# EAGLE schematic Motor_Cape (EAGLE 7.7.0)
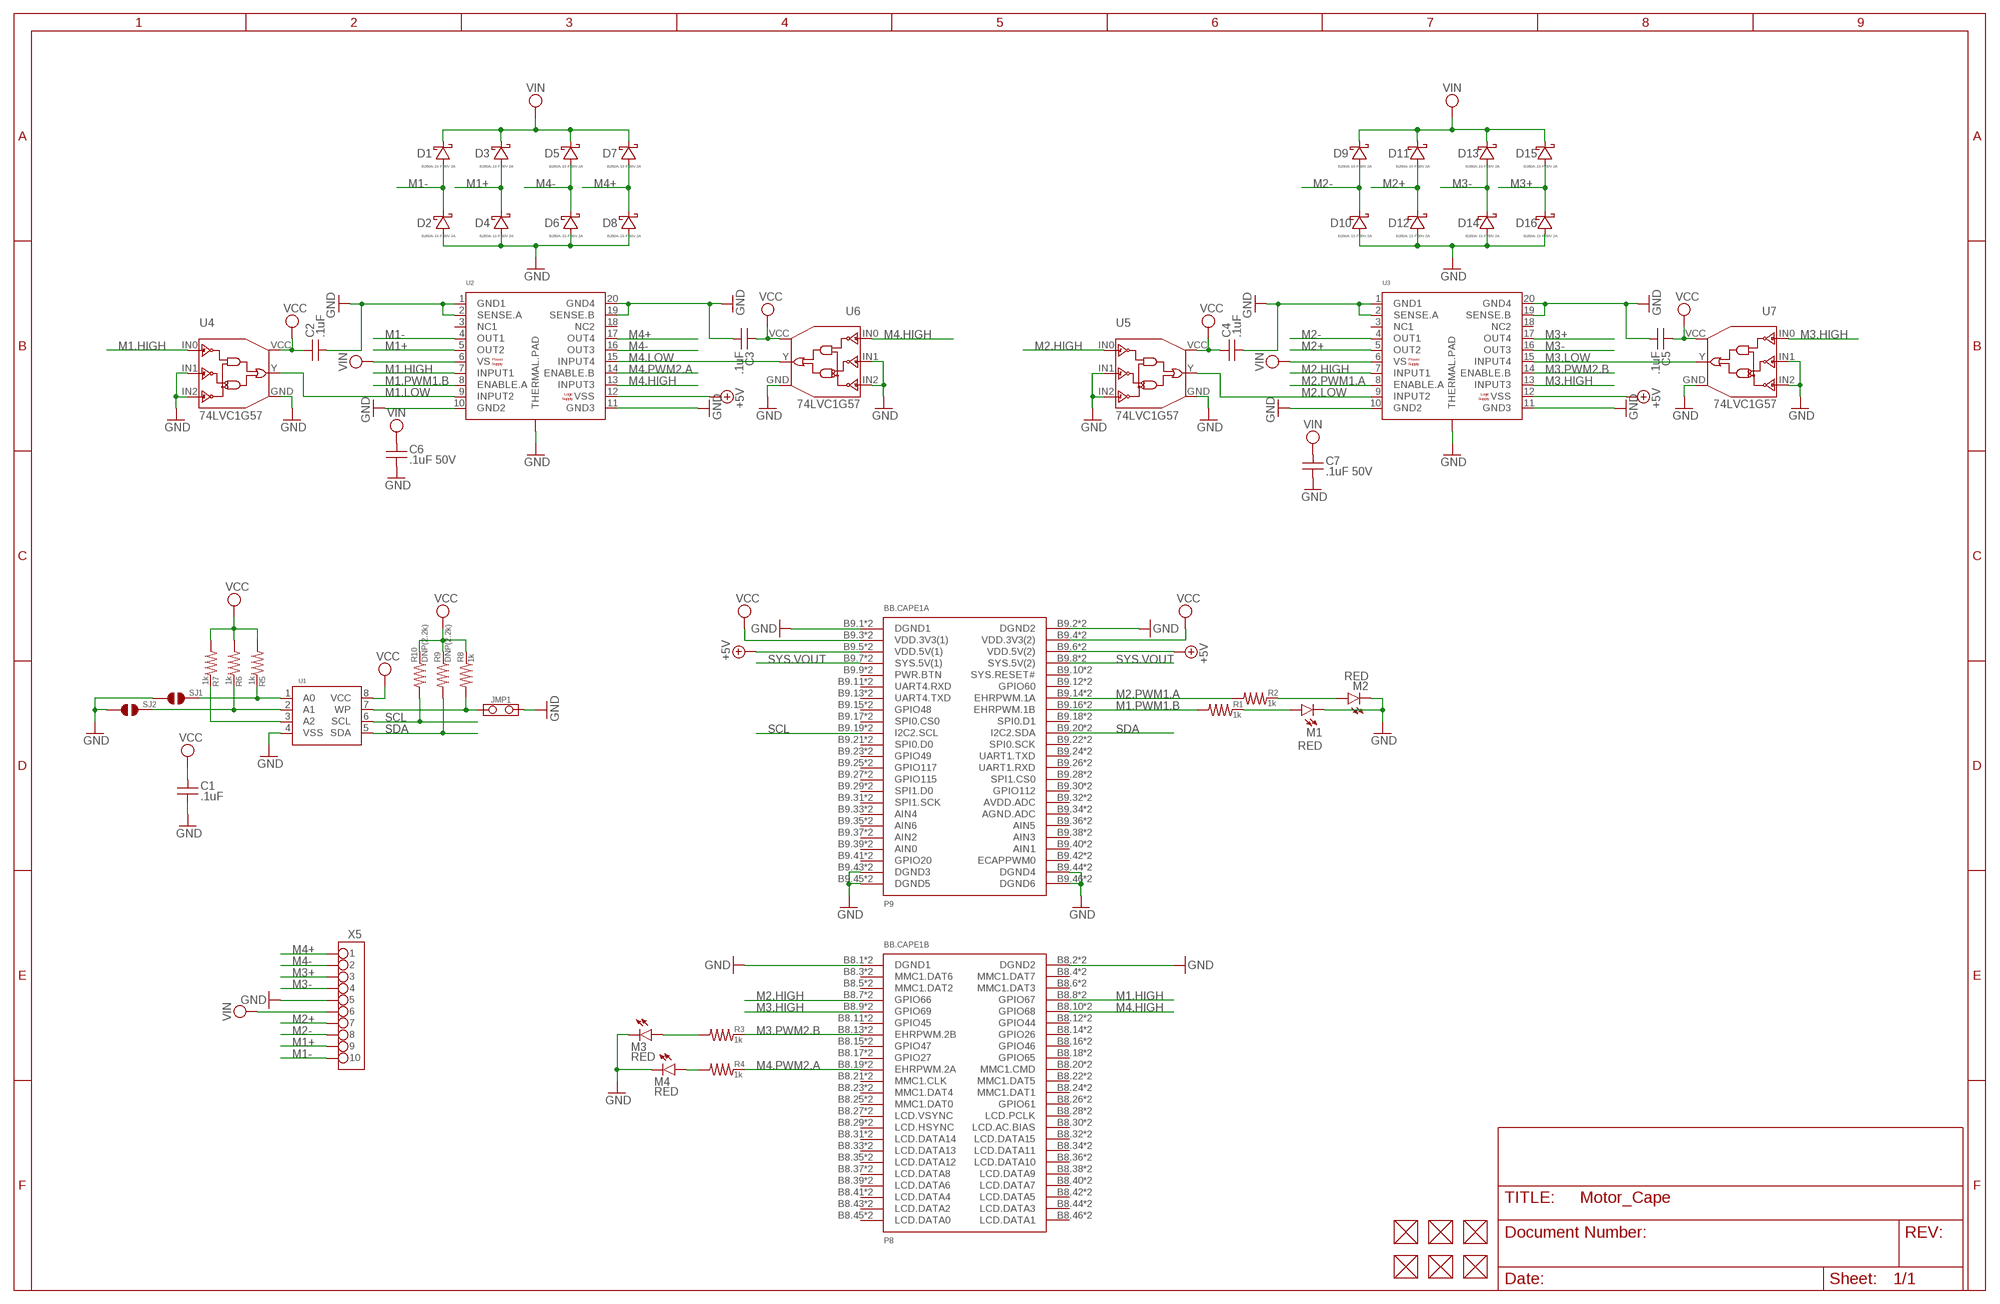
[diagram p0: schematic, sheet 1]

## Parts
BB.CAPE1  BEAGLEBONE.CAPE.TOP/BOTTOM-PADS  [BEAGLEBONE.CAPE.TOP/BOTTOM-PADS]
C1  .1uF  CAPACITOR-(INCH)-0402  [0402]
C2  .1uF  CAPACITOR-(INCH)-0402  [0402]
C3  .1uF  CAPACITOR-(INCH)-0402  [0402]
C4  .1uF  CAPACITOR-(INCH)-0402  [0402]
C5  .1uF  CAPACITOR-(INCH)-0402  [0402]
C6  .1uF 50V  CAPACITOR-(INCH)-0603  [0603]
C7  .1uF 50V  CAPACITOR-(INCH)-0603  [0603]
D1  B260A-13-F 60V 2A  DIODE-SCHOTTKY-(DIODES)-SMA  [SMA(DIODES)]
D2  B260A-13-F 60V 2A  DIODE-SCHOTTKY-(DIODES)-SMA  [SMA(DIODES)]
D3  B260A-13-F 60V 2A  DIODE-SCHOTTKY-(DIODES)-SMA  [SMA(DIODES)]
D4  B260A-13-F 60V 2A  DIODE-SCHOTTKY-(DIODES)-SMA  [SMA(DIODES)]
D5  B260A-13-F 60V 2A  DIODE-SCHOTTKY-(DIODES)-SMA  [SMA(DIODES)]
D6  B260A-13-F 60V 2A  DIODE-SCHOTTKY-(DIODES)-SMA  [SMA(DIODES)]
D7  B260A-13-F 60V 2A  DIODE-SCHOTTKY-(DIODES)-SMA  [SMA(DIODES)]
D8  B260A-13-F 60V 2A  DIODE-SCHOTTKY-(DIODES)-SMA  [SMA(DIODES)]
D9  B260A-13-F 60V 2A  DIODE-SCHOTTKY-(DIODES)-SMA  [SMA(DIODES)]
D10  B260A-13-F 60V 2A  DIODE-SCHOTTKY-(DIODES)-SMA  [SMA(DIODES)]
D11  B260A-13-F 60V 2A  DIODE-SCHOTTKY-(DIODES)-SMA  [SMA(DIODES)]
D12  B260A-13-F 60V 2A  DIODE-SCHOTTKY-(DIODES)-SMA  [SMA(DIODES)]
D13  B260A-13-F 60V 2A  DIODE-SCHOTTKY-(DIODES)-SMA  [SMA(DIODES)]
D14  B260A-13-F 60V 2A  DIODE-SCHOTTKY-(DIODES)-SMA  [SMA(DIODES)]
D15  B260A-13-F 60V 2A  DIODE-SCHOTTKY-(DIODES)-SMA  [SMA(DIODES)]
D16  B260A-13-F 60V 2A  DIODE-SCHOTTKY-(DIODES)-SMA  [SMA(DIODES)]
FUD1  FIDUCIAL  [FIDUCIAL_40MIL]
FUD2  FIDUCIAL  [FIDUCIAL_40MIL]
FUD3  FIDUCIAL  [FIDUCIAL_40MIL]
FUD4  FIDUCIAL  [FIDUCIAL_40MIL]
FUD5  FIDUCIAL  [FIDUCIAL_40MIL]
FUD6  FIDUCIAL  [FIDUCIAL_40MIL]
JMP1  JUMPER-(X2)  [JUMPER-(X2)]
M1  RED  LED-(INCH)-0805  [0805-LED]
M2  RED  LED-(INCH)-0805  [0805-LED]
M3  RED  LED-(INCH)-0805  [0805-LED]
M4  RED  LED-(INCH)-0805  [0805-LED]
R1  1k  RESISTOR-(INCH)-0402  [0402]
R2  1k  RESISTOR-(INCH)-0402  [0402]
R3  1k  RESISTOR-(INCH)-0402  [0402]
R4  1k  RESISTOR-(INCH)-0402  [0402]
R5  1k  RESISTOR-(INCH)-0402  [0402]
R6  1k  RESISTOR-(INCH)-0402  [0402]
R7  1k  RESISTOR-(INCH)-0402  [0402]
R8  1k  RESISTOR-(INCH)-0402  [0402]
R9  DNP(2.2k)  RESISTOR-(INCH)-0402  [0402]
R10  DNP(2.2k)  RESISTOR-(INCH)-0402  [0402]
SJ1  SOLDER.JOINT-(INCH)-0402  [SOLDER.JOINT(0402)]
SJ2  SOLDER.JOINT-(INCH)-0402  [SOLDER.JOINT(0402)]
U1  CAT24C32  [UDFN8,2X3(ON-SEMI)]
U2  ST-L298-TP(VERSION.A)-W/TV  [POWER.SO-20(ST)-A.W/TV]
U3  ST-L298-TP(VERSION.A)-W/TV  [POWER.SO-20(ST)-A.W/TV]
U4  74LVC1G57  [SOT-23-6]
U5  74LVC1G57  [SOT-23-6]
U6  74LVC1G57  [SOT-23-6]
U7  74LVC1G57  [SOT-23-6]
X5  TB-10TERM-150MIL.PITCH  [TERMINAL.BLOCK-10TERM-150MIL.PITCH]

## Nets
+5V [power]: BB.CAPE1.B9.5(A:VDD.5V(1)) BB.CAPE1.B9.6(A:VDD.5V(2)) BB.CAPE1.T9.5(A:VDD.5V(1)) BB.CAPE1.T9.6(A:VDD.5V(2)) U2.12(VSS) U3.12(VSS)
A0: R5.2 SJ1.2 U1.1(A0)
A1: R6.2 SJ2.2 U1.2(A1)
A2: R7.2 U1.3(A2)
GND: BB.CAPE1.B8.1(B:DGND1) BB.CAPE1.B8.2(B:DGND2) BB.CAPE1.B9.1(A:DGND1) BB.CAPE1.B9.2(A:DGND2) BB.CAPE1.B9.43(A:DGND3) BB.CAPE1.B9.44(A:DGND4) BB.CAPE1.B9.45(A:DGND5) BB.CAPE1.B9.46(A:DGND6) BB.CAPE1.T8.1(B:DGND1) BB.CAPE1.T8.2(B:DGND2) BB.CAPE1.T9.1(A:DGND1) BB.CAPE1.T9.2(A:DGND2) BB.CAPE1.T9.43(A:DGND3) BB.CAPE1.T9.44(A:DGND4) BB.CAPE1.T9.45(A:DGND5) BB.CAPE1.T9.46(A:DGND6) C1.2 C2.2 C3.2 C4.2 C5.2 C6.2 C7.2 D2.A(ANODE) D4.A(ANODE) D6.A(ANODE) D8.A(ANODE) D10.A(ANODE) D12.A(ANODE) D14.A(ANODE) D16.A(ANODE) JMP1.2 M1.K M2.K M3.K M4.K SJ1.1 SJ2.1 U1.4(VSS) U2.1(GND1) U2.2(SENSE.A) U2.10(GND2) U2.11(GND3) U2.19(SENSE.B) U2.20(GND4) U2.THERMAL.PAD U2.TV1(THERMAL.PAD) U2.TV2(THERMAL.PAD) U2.TV3(THERMAL.PAD) U2.TV4(THERMAL.PAD) U2.TV5(THERMAL.PAD) U2.TV6(THERMAL.PAD) U2.TV7(THERMAL.PAD) U2.TV8(THERMAL.PAD) U2.TV9(THERMAL.PAD) U2.TV10(THERMAL.PAD) U2.TV11(THERMAL.PAD) U2.TV12(THERMAL.PAD) U2.TV13(THERMAL.PAD) U2.TV14(THERMAL.PAD) U2.TV15(THERMAL.PAD) U2.TV16(THERMAL.PAD) U2.TV17(THERMAL.PAD) U2.TV18(THERMAL.PAD) U2.TV19(THERMAL.PAD) U2.TV20(THERMAL.PAD) U2.TV21(THERMAL.PAD) U3.1(GND1) U3.2(SENSE.A) U3.10(GND2) U3.11(GND3) U3.19(SENSE.B) U3.20(GND4) U3.THERMAL.PAD U3.TV1(THERMAL.PAD) U3.TV2(THERMAL.PAD) U3.TV3(THERMAL.PAD) U3.TV4(THERMAL.PAD) U3.TV5(THERMAL.PAD) U3.TV6(THERMAL.PAD) U3.TV7(THERMAL.PAD) U3.TV8(THERMAL.PAD) U3.TV9(THERMAL.PAD) U3.TV10(THERMAL.PAD) U3.TV11(THERMAL.PAD) U3.TV12(THERMAL.PAD) U3.TV13(THERMAL.PAD) U3.TV14(THERMAL.PAD) U3.TV15(THERMAL.PAD) U3.TV16(THERMAL.PAD) U3.TV17(THERMAL.PAD) U3.TV18(THERMAL.PAD) U3.TV19(THERMAL.PAD) U3.TV20(THERMAL.PAD) U3.TV21(THERMAL.PAD) U4.GND U4.IN1 U4.IN2 U5.GND U5.IN1 U5.IN2 U6.GND U6.IN1 U6.IN2 U7.GND U7.IN1 U7.IN2 X5.5
M1+: D3.A(ANODE) D4.K(CATHODE) U2.5(OUT2) X5.9
M1-: D1.A(ANODE) D2.K(CATHODE) U2.4(OUT1) X5.10
M1.HIGH: BB.CAPE1.B8.8(B:GPIO67) BB.CAPE1.T8.8(B:GPIO67) U2.7(INPUT1) U4.IN0
M1.LOW: U2.9(INPUT2) U4.Y
M1.PWM1.B: BB.CAPE1.B9.16(A:EHRPWM.1B) BB.CAPE1.T9.16(A:EHRPWM.1B) R1.1 U2.8(ENABLE.A)
M2+: D11.A(ANODE) D12.K(CATHODE) U3.5(OUT2) X5.7
M2-: D9.A(ANODE) D10.K(CATHODE) U3.4(OUT1) X5.8
M2.HIGH: BB.CAPE1.B8.7(B:GPIO66) BB.CAPE1.T8.7(B:GPIO66) U3.7(INPUT1) U5.IN0
M2.LOW: U3.9(INPUT2) U5.Y
M2.PWM1.A: BB.CAPE1.B9.14(A:EHRPWM.1A) BB.CAPE1.T9.14(A:EHRPWM.1A) R2.1 U3.8(ENABLE.A)
M3+: D15.A(ANODE) D16.K(CATHODE) U3.17(OUT4) X5.3
M3-: D13.A(ANODE) D14.K(CATHODE) U3.16(OUT3) X5.4
M3.HIGH: BB.CAPE1.B8.9(B:GPIO69) BB.CAPE1.T8.9(B:GPIO69) U3.13(INPUT3) U7.IN0
M3.LOW: U3.15(INPUT4) U7.Y
M3.PWM2.B: BB.CAPE1.B8.13(B:EHRPWM.2B) BB.CAPE1.T8.13(B:EHRPWM.2B) R3.2 U3.14(ENABLE.B)
M4+: D7.A(ANODE) D8.K(CATHODE) U2.17(OUT4) X5.1
M4-: D5.A(ANODE) D6.K(CATHODE) U2.16(OUT3) X5.2
M4.HIGH: BB.CAPE1.B8.10(B:GPIO68) BB.CAPE1.T8.10(B:GPIO68) U2.13(INPUT3) U6.IN0
M4.LOW: U2.15(INPUT4) U6.Y
M4.PWM2.A: BB.CAPE1.B8.19(B:EHRPWM.2A) BB.CAPE1.T8.19(B:EHRPWM.2A) R4.2 U2.14(ENABLE.B)
N$3: M1.A R1.2
N$4: M2.A R2.2
N$5: M3.A R3.1
N$6: M4.A R4.1
SCL: BB.CAPE1.B9.19(A:I2C2.SCL) BB.CAPE1.T9.19(A:I2C2.SCL) R10.1 U1.6(SCL)
SDA: BB.CAPE1.B9.20(A:I2C2.SDA) BB.CAPE1.T9.20(A:I2C2.SDA) R9.1 U1.5(SDA)
SYS.VOUT: BB.CAPE1.B9.7(A:SYS.5V(1)) BB.CAPE1.B9.8(A:SYS.5V(2)) BB.CAPE1.T9.7(A:SYS.5V(1)) BB.CAPE1.T9.8(A:SYS.5V(2))
VCC: BB.CAPE1.B9.3(A:VDD.3V3(1)) BB.CAPE1.B9.4(A:VDD.3V3(2)) BB.CAPE1.T9.3(A:VDD.3V3(1)) BB.CAPE1.T9.4(A:VDD.3V3(2)) C1.1 C2.1 C3.1 C4.1 C5.1 R5.1 R6.1 R7.1 R8.2 R9.2 R10.2 U1.8(VCC) U4.VCC U5.VCC U6.VCC U7.VCC
VIN: C6.1 C7.1 D1.K(CATHODE) D3.K(CATHODE) D5.K(CATHODE) D7.K(CATHODE) D9.K(CATHODE) D11.K(CATHODE) D13.K(CATHODE) D15.K(CATHODE) U2.6(VS) U3.6(VS) X5.6
WP: JMP1.1 R8.1 U1.7(WP)
Unconnected: BB.CAPE1.B8.3(B:MMC1.DAT6) BB.CAPE1.B8.4(B:MMC1.DAT7) BB.CAPE1.B8.5(B:MMC1.DAT2) BB.CAPE1.B8.6(B:MMC1.DAT3) BB.CAPE1.B8.11(B:GPIO45) BB.CAPE1.B8.12(B:GPIO44) BB.CAPE1.B8.14(B:GPIO26) BB.CAPE1.B8.15(B:GPIO47) BB.CAPE1.B8.16(B:GPIO46) BB.CAPE1.B8.17(B:GPIO27) BB.CAPE1.B8.18(B:GPIO65) BB.CAPE1.B8.20(B:MMC1.CMD) BB.CAPE1.B8.21(B:MMC1.CLK) BB.CAPE1.B8.22(B:MMC1.DAT5) BB.CAPE1.B8.23(B:MMC1.DAT4) BB.CAPE1.B8.24(B:MMC1.DAT1) BB.CAPE1.B8.25(B:MMC1.DAT0) BB.CAPE1.B8.26(B:GPIO61) BB.CAPE1.B8.27(B:LCD.VSYNC) BB.CAPE1.B8.28(B:LCD.PCLK) BB.CAPE1.B8.29(B:LCD.HSYNC) BB.CAPE1.B8.30(B:LCD.AC.BIAS) BB.CAPE1.B8.31(B:LCD.DATA14) BB.CAPE1.B8.32(B:LCD.DATA15) BB.CAPE1.B8.33(B:LCD.DATA13) BB.CAPE1.B8.34(B:LCD.DATA11) BB.CAPE1.B8.35(B:LCD.DATA12) BB.CAPE1.B8.36(B:LCD.DATA10) BB.CAPE1.B8.37(B:LCD.DATA8) BB.CAPE1.B8.38(B:LCD.DATA9) BB.CAPE1.B8.39(B:LCD.DATA6) BB.CAPE1.B8.40(B:LCD.DATA7) BB.CAPE1.B8.41(B:LCD.DATA4) BB.CAPE1.B8.42(B:LCD.DATA5) BB.CAPE1.B8.43(B:LCD.DATA2) BB.CAPE1.B8.44(B:LCD.DATA3) BB.CAPE1.B8.45(B:LCD.DATA0) BB.CAPE1.B8.46(B:LCD.DATA1) BB.CAPE1.B9.9(A:PWR.BTN) BB.CAPE1.B9.10(A:SYS.RESET#) BB.CAPE1.B9.11(A:UART4.RXD) BB.CAPE1.B9.12(A:GPIO60) BB.CAPE1.B9.13(A:UART4.TXD) BB.CAPE1.B9.15(A:GPIO48) BB.CAPE1.B9.17(A:SPI0.CS0) BB.CAPE1.B9.18(A:SPI0.D1) BB.CAPE1.B9.21(A:SPI0.D0) BB.CAPE1.B9.22(A:SPI0.SCK) BB.CAPE1.B9.23(A:GPIO49) BB.CAPE1.B9.24(A:UART1.TXD) BB.CAPE1.B9.25(A:GPIO117) BB.CAPE1.B9.26(A:UART1.RXD) BB.CAPE1.B9.27(A:GPIO115) BB.CAPE1.B9.28(A:SPI1.CS0) BB.CAPE1.B9.29(A:SPI1.D0) BB.CAPE1.B9.30(A:GPIO112) BB.CAPE1.B9.31(A:SPI1.SCK) BB.CAPE1.B9.32(A:AVDD.ADC) BB.CAPE1.B9.33(A:AIN4) BB.CAPE1.B9.34(A:AGND.ADC) BB.CAPE1.B9.35(A:AIN6) BB.CAPE1.B9.36(A:AIN5) BB.CAPE1.B9.37(A:AIN2) BB.CAPE1.B9.38(A:AIN3) BB.CAPE1.B9.39(A:AIN0) BB.CAPE1.B9.40(A:AIN1) BB.CAPE1.B9.41(A:GPIO20) BB.CAPE1.B9.42(A:ECAPPWM0) BB.CAPE1.T8.3(B:MMC1.DAT6) BB.CAPE1.T8.4(B:MMC1.DAT7) BB.CAPE1.T8.5(B:MMC1.DAT2) BB.CAPE1.T8.6(B:MMC1.DAT3) BB.CAPE1.T8.11(B:GPIO45) BB.CAPE1.T8.12(B:GPIO44) BB.CAPE1.T8.14(B:GPIO26) BB.CAPE1.T8.15(B:GPIO47) BB.CAPE1.T8.16(B:GPIO46) BB.CAPE1.T8.17(B:GPIO27) BB.CAPE1.T8.18(B:GPIO65) BB.CAPE1.T8.20(B:MMC1.CMD) BB.CAPE1.T8.21(B:MMC1.CLK) BB.CAPE1.T8.22(B:MMC1.DAT5) BB.CAPE1.T8.23(B:MMC1.DAT4) BB.CAPE1.T8.24(B:MMC1.DAT1) BB.CAPE1.T8.25(B:MMC1.DAT0) BB.CAPE1.T8.26(B:GPIO61) BB.CAPE1.T8.27(B:LCD.VSYNC) BB.CAPE1.T8.28(B:LCD.PCLK) BB.CAPE1.T8.29(B:LCD.HSYNC) BB.CAPE1.T8.30(B:LCD.AC.BIAS) BB.CAPE1.T8.31(B:LCD.DATA14) BB.CAPE1.T8.32(B:LCD.DATA15) BB.CAPE1.T8.33(B:LCD.DATA13) BB.CAPE1.T8.34(B:LCD.DATA11) BB.CAPE1.T8.35(B:LCD.DATA12) BB.CAPE1.T8.36(B:LCD.DATA10) BB.CAPE1.T8.37(B:LCD.DATA8) BB.CAPE1.T8.38(B:LCD.DATA9) BB.CAPE1.T8.39(B:LCD.DATA6) BB.CAPE1.T8.40(B:LCD.DATA7) BB.CAPE1.T8.41(B:LCD.DATA4) BB.CAPE1.T8.42(B:LCD.DATA5) BB.CAPE1.T8.43(B:LCD.DATA2) BB.CAPE1.T8.44(B:LCD.DATA3) BB.CAPE1.T8.45(B:LCD.DATA0) BB.CAPE1.T8.46(B:LCD.DATA1) BB.CAPE1.T9.9(A:PWR.BTN) BB.CAPE1.T9.10(A:SYS.RESET#) BB.CAPE1.T9.11(A:UART4.RXD) BB.CAPE1.T9.12(A:GPIO60) BB.CAPE1.T9.13(A:UART4.TXD) BB.CAPE1.T9.15(A:GPIO48) BB.CAPE1.T9.17(A:SPI0.CS0) BB.CAPE1.T9.18(A:SPI0.D1) BB.CAPE1.T9.21(A:SPI0.D0) BB.CAPE1.T9.22(A:SPI0.SCK) BB.CAPE1.T9.23(A:GPIO49) BB.CAPE1.T9.24(A:UART1.TXD) BB.CAPE1.T9.25(A:GPIO117) BB.CAPE1.T9.26(A:UART1.RXD) BB.CAPE1.T9.27(A:GPIO115) BB.CAPE1.T9.28(A:SPI1.CS0) BB.CAPE1.T9.29(A:SPI1.D0) BB.CAPE1.T9.30(A:GPIO112) BB.CAPE1.T9.31(A:SPI1.SCK) BB.CAPE1.T9.32(A:AVDD.ADC) BB.CAPE1.T9.33(A:AIN4) BB.CAPE1.T9.34(A:AGND.ADC) BB.CAPE1.T9.35(A:AIN6) BB.CAPE1.T9.36(A:AIN5) BB.CAPE1.T9.37(A:AIN2) BB.CAPE1.T9.38(A:AIN3) BB.CAPE1.T9.39(A:AIN0) BB.CAPE1.T9.40(A:AIN1) BB.CAPE1.T9.41(A:GPIO20) BB.CAPE1.T9.42(A:ECAPPWM0) FUD1.P$1 FUD2.P$1 FUD3.P$1 FUD4.P$1 FUD5.P$1 FUD6.P$1 U2.3(NC1) U2.18(NC2) U3.3(NC1) U3.18(NC2)

## Library data of the parts
BB.CAPE1 = GHI-Solutions:BEAGLEBONE.CAPE.
C1-C7 = GHI-BasicComponents:CAPACITOR-(INCH)-: Basic SMD ceramic capacitors
D1-D16 = GHI-BasicComponents:DIODE-SCHOTTKY-(DIODES)-
FUD1-FUD6 = GHI:FIDUCIAL
JMP1 = GHI-Headers:JUMPER-(X2)
M1-M4 = GHI-BasicComponents:LED-(INCH)-: Basic SMD LEDs
R1-R10 = GHI-BasicComponents:RESISTOR-(INCH)-: Basic SMD Resistors
SJ1 SJ2 = GHI-Miscellaneous:SOLDER.JOINT-(INCH)-: Solder Joint (Bridge) Pads - For easy solder joining.
U1 = GHI-IC:CAT24C32: 32-Kb I2C CMOS Serial EEPROM
U2 U3 = GHI-IC:ST-L298-: ST DUAL FULL-BRIDGE DRIVER (example use: Motor Controller)
U4-U7 = GHI-IC:74LVC1G57: A Multi-Functional Logic Gate: AND, OR, Inverter
X5 = GHI-Connectors:TB-10TERM-150MIL.PITCH